# Altium project BCM_ECU.PrjPcb (part 3 of 3)

## Sheet MCP23017_PINOUT.SchDoc
size B; SheetNumber: 11; SheetTotal: 15
Used 2 times, as channels IO_CHECKER_0, IO_CHECKER_1. Parts and nets are listed once, with the designators drawn on the sheet.
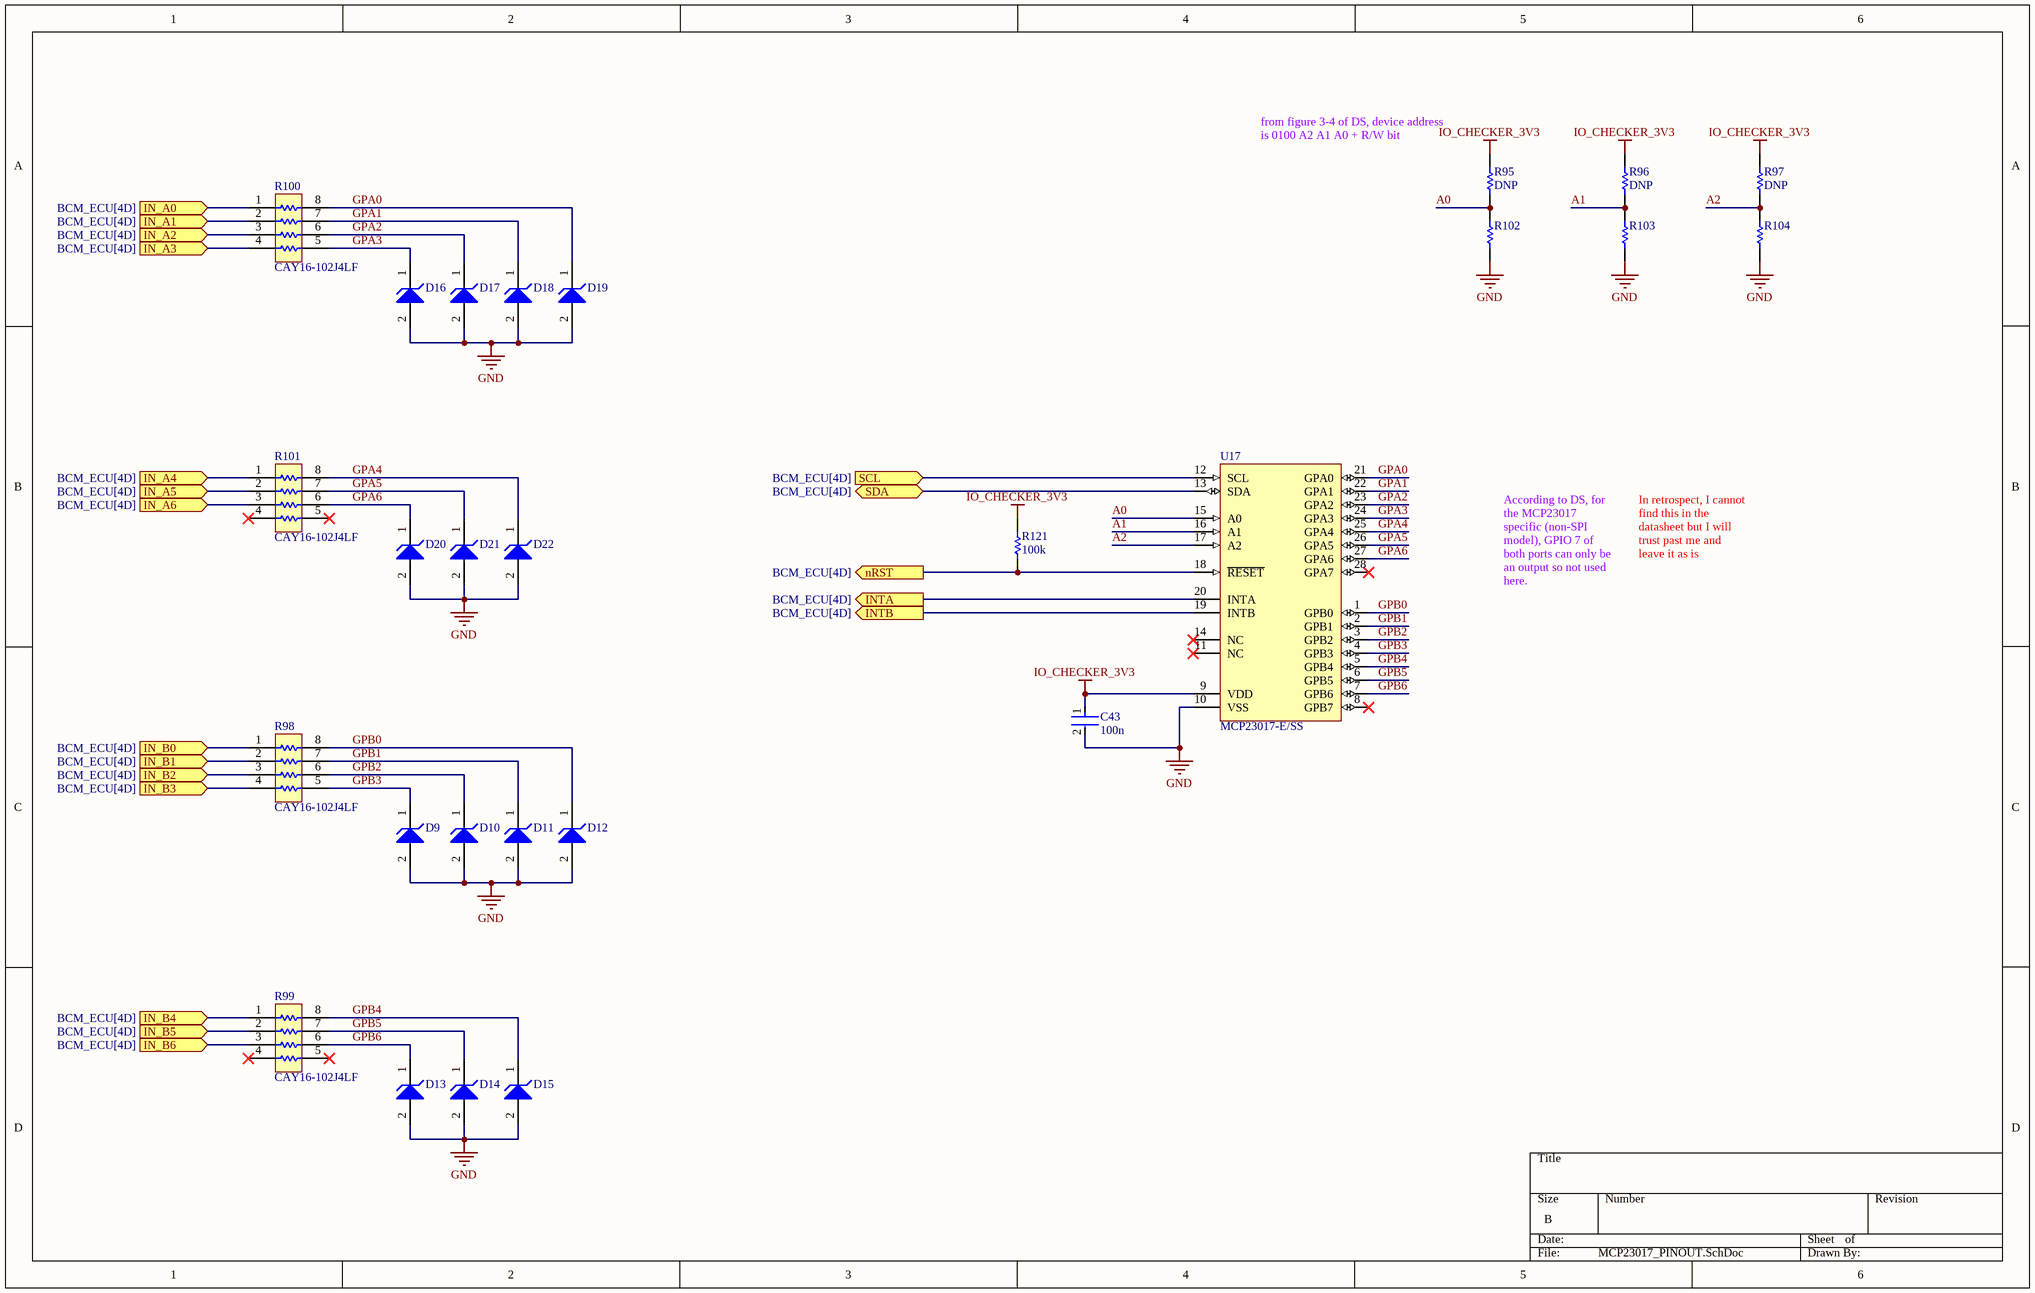
[diagram p16: MCP23017_PINOUT.SchDoc]

### Parts
C43  100n  [FP-0402-L_1_0_0_05-W_0_5-IPC_A]
D9  MM5Z3V3T1G  [ONSC-SOD-523-2-502-01_V]  (value not drawn)
D10  MM5Z3V3T1G  [ONSC-SOD-523-2-502-01_V]  (value not drawn)
D11  MM5Z3V3T1G  [ONSC-SOD-523-2-502-01_V]  (value not drawn)
D12  MM5Z3V3T1G  [ONSC-SOD-523-2-502-01_V]  (value not drawn)
D13  MM5Z3V3T1G  [ONSC-SOD-523-2-502-01_V]  (value not drawn)
D14  MM5Z3V3T1G  [ONSC-SOD-523-2-502-01_V]  (value not drawn)
D15  MM5Z3V3T1G  [ONSC-SOD-523-2-502-01_V]  (value not drawn)
D16  MM5Z3V3T1G  [ONSC-SOD-523-2-502-01_V]  (value not drawn)
D17  MM5Z3V3T1G  [ONSC-SOD-523-2-502-01_V]  (value not drawn)
D18  MM5Z3V3T1G  [ONSC-SOD-523-2-502-01_V]  (value not drawn)
D19  MM5Z3V3T1G  [ONSC-SOD-523-2-502-01_V]  (value not drawn)
D20  MM5Z3V3T1G  [ONSC-SOD-523-2-502-01_V]  (value not drawn)
D21  MM5Z3V3T1G  [ONSC-SOD-523-2-502-01_V]  (value not drawn)
D22  MM5Z3V3T1G  [ONSC-SOD-523-2-502-01_V]  (value not drawn)
R95  DNP  [R0603B]
R96  DNP  [R0603B]
R97  DNP  [R0603B]
R98  CAY16-102J4LF  [BOUR-CAY16-J4_V]
R99  CAY16-102J4LF  [BOUR-CAY16-J4_V]
R100  CAY16-102J4LF  [BOUR-CAY16-J4_V]
R101  CAY16-102J4LF  [BOUR-CAY16-J4_V]
R102  DNP  [RESC1005X40X25ML05T05]  (value not drawn)
R103  DNP  [RESC1005X40X25ML05T05]  (value not drawn)
R104  DNP  [RESC1005X40X25ML05T05]  (value not drawn)
R121  100k  [R0603B]
U17  MCP23017-E/SS  [SSOP-SS28_N]

### Ports
IN_A0 (in, see BCM_ECU[4D]), IN_A1 (in, see BCM_ECU[4D]), IN_A2 (in, see BCM_ECU[4D]), IN_A3 (in, see BCM_ECU[4D]), IN_A4 (in, see BCM_ECU[4D]), IN_A5 (in, see BCM_ECU[4D]), IN_A6 (in, see BCM_ECU[4D]), IN_B0 (in, see BCM_ECU[4D]), IN_B1 (in, see BCM_ECU[4D]), IN_B2 (in, see BCM_ECU[4D]), IN_B3 (in, see BCM_ECU[4D]), IN_B4 (in, see BCM_ECU[4D]), IN_B5 (in, see BCM_ECU[4D]), IN_B6 (in, see BCM_ECU[4D]), INTA (out, see BCM_ECU[4D]), INTB (out, see BCM_ECU[4D]), nRST (out, see BCM_ECU[4D]), SCL (in, see BCM_ECU[4D]), SDA (bidir, see BCM_ECU[4D])

### Nets
GND: C43.2 D9.2(A) D10.2(A) D11.2(A) D12.2(A) D13.2(A) D14.2(A) D15.2(A) D16.2(A) D17.2(A) D18.2(A) D19.2(A) D20.2(A) D21.2(A) D22.2(A) R102.1 R103.1 R104.1 U17.10(VSS)
IO_CHECKER_3V3: C43.1 R95.2 R96.2 R97.2 R121.2 U17.9(VDD)
A0: R95.1 R102.2 U17.15(A0)
A1: R96.1 R103.2 U17.16(A1)
A2: R97.1 R104.2 U17.17(A2)
GPA0: D19.1(K) R100.8 U17.21(GPA0)
GPA1: D18.1(K) R100.7 U17.22(GPA1)
GPA2: D17.1(K) R100.6 U17.23(GPA2)
GPA3: D16.1(K) R100.5 U17.24(GPA3)
GPA4: D22.1(K) R101.8 U17.25(GPA4)
GPA5: D21.1(K) R101.7 U17.26(GPA5)
GPA6: D20.1(K) R101.6 U17.27(GPA6)
GPB0: D12.1(K) R98.8 U17.1(GPB0)
GPB1: D11.1(K) R98.7 U17.2(GPB1)
GPB2: D10.1(K) R98.6 U17.3(GPB2)
GPB3: D9.1(K) R98.5 U17.4(GPB3)
GPB4: D15.1(K) R99.8 U17.5(GPB4)
GPB5: D14.1(K) R99.7 U17.6(GPB5)
GPB6: D13.1(K) R99.6 U17.7(GPB6)
IN_A0: R100.1 ; port IN_A0
IN_A1: R100.2 ; port IN_A1
IN_A2: R100.3 ; port IN_A2
IN_A3: R100.4 ; port IN_A3
IN_A4: R101.1 ; port IN_A4
IN_A5: R101.2 ; port IN_A5
IN_A6: R101.3 ; port IN_A6
IN_B0: R98.1 ; port IN_B0
IN_B1: R98.2 ; port IN_B1
IN_B2: R98.3 ; port IN_B2
IN_B3: R98.4 ; port IN_B3
IN_B4: R99.1 ; port IN_B4
IN_B5: R99.2 ; port IN_B5
IN_B6: R99.3 ; port IN_B6
INTA: U17.20(INTA) ; port INTA
INTB: U17.19(INTB) ; port INTB
nRST: R121.1 U17.18(~{RESET}) ; port nRST
SCL: U17.12(SCL) ; port SCL
SDA: U17.13(SDA) ; port SDA

Not connected (* = marked no-connect by the designer): R99 4* 5*; R101 4* 5*; U17 8(GPB7)* 11(NC)* 14(NC)* 28(GPA7)*

### Channels
IO_CHECKER_0: designators end in _IO_CHECKER_0; ports IN_A0=EXT_IN_1 IN_A1=EXT_IN_2 IN_A2=OUT_1 IN_A3=EXT_IN_0 IN_A4=EXT_IN_3 IN_A5=OUT_0 IN_A6=NetR101_IO_CHECKER_0_3 IN_B0=EXT_INT_6 IN_B1=EXT_INT_2 IN_B2=EXT_INT_5 IN_B3=EXT_INT_1 IN_B4=EXT_INT_4 IN_B5=EXT_INT_0 IN_B6=EXT_INT_3 INTA=NetU10_61 INTB=NetU10_60 nRST=NetR121_IO_CHECKER_0_1 SCL=IO_CHKR_SCL SDA=IO_CHKR_SDA
IO_CHECKER_1: designators end in _IO_CHECKER_1; ports IN_A0=OUT_13 IN_A1=OUT_12 IN_A2=OUT_10 IN_A3=OUT_15 IN_A4=OUT_11 IN_A5=OUT_14 IN_A6=OUT_8 IN_B0=OUT_9 IN_B1=OUT_6 IN_B2=OUT_7 IN_B3=OUT_4 IN_B4=OUT_5 IN_B5=OUT_2 IN_B6=OUT_3 INTA=NetU10_91 INTB=NetU10_90 nRST=NetR121_IO_CHECKER_1_1 SCL=IO_CHKR_SCL SDA=IO_CHKR_SDA

### Notes on the sheet
- (near R95) from figure 3-4 of DS, device address is 0100 A2 A1 A0 + R/W bit
- According to DS, for the MCP23017 specific (non-SPI model), GPIO 7 of both ports can only be an output so not used here.
- In retrospect, I cannot find this in the datasheet but I will trust past me and leave it as is

### Library data of the parts
C43 = CMP-001-00058-1: LARGE PADS, 0402 CAP, CHANGE COMMENT TO MATCH REAL P/N; Capacitor Type: Ceramic; Min Operating Temperature: -55°C; Mounting Technology: Surface Mount; Pins: 2; Case/Package: 0402; RoHS Compliant: Yes; Max Operating Temperature: 85°C
D9-D22 = CMP-1060-00750-1: Zener Voltage Regulator, 500 mW, 2-Pin SOD-523, Pb-Free, Tape and Reel; Manufacturer: On Semiconductor; P Max (W): 0.5; VZ Typ (V): 3.3; RoHS: Pb-Free; ComponentLink2Description: Datasheet; PackageReference: SOD-523-2-502-01; DatasheetVersion: Rev. 10; ComponentLink1Description: Manufacturer URL; PackageVersion: Rev. E, 09/2010; ComponentLink3URL: http://www.onsemi.com/pub_link/Collateral/502-01.PDF; ComponentLink2URL: http://www.onsemi.cn/pub_link/Collateral/MM5Z2V4T1-D.PDF; Mounting Technology: Surface Mount; PartNumber: MM5Z3V3T1G; Packing: Tape and Reel; PackageDescription: 2-Pin SOD, Body 1.2 x 0.8 mm; ComponentLink1URL: http://www.onsemi.com/; ComponentLink3Description: Package Specification
R95-R97 = CMP-009-00002-14: Resistor; Value: 100k
R98-R101 = CMP-1747-00007-1: Chip Resistor Array, 1 KOhm, +/- 5%, 62.5 mW, -55 to 125 degC, 8-Pin SMD, RoHS, Tape and Reel; Power Rating: 100 mW; Tolerance: 1%; Voltage Rating (DC): 50 V; Resistance: 330 Ohm; Case\Package: 0603; RoHSCompliant: true; Case Code (Metric): 1608; Pins: 2; PackageDescription: 8-Pin Surface Mount Device, Body 1.6 x 3.2 mm, Pitch 0.8 mm; Height: 0.45 mm; Min Operating Temperature: -55 degC; ComponentLink1URL: http://www.bourns.com/; Case Code (Imperial): 0603; Packaging: Tape and Reel; PackageReference: CAY16-J4; ComponentLink1Description: Manufacturer URL; ComponentLink2Description: Datasheet; Length: 1.6 mm; Width: 0.8 mm; Max Operating Temperature: 155 degC; Mount: Surface Mount; DatasheetVersion: Sep-14; Voltage Rating: 50 V; REACH SVHC: No SVHC; ComponentLink2URL: http://www.bourns.com/pdfs/CATCAY.pdf; Package Quantity: 5000
R102-R104 = CMP-009-00118-2: READ THE NAME; Pins: 2; Component Type: Standard; Design Item ID: CMP-009-00206-2; Source: 0402jump.SchLib
R121 = CMP-009-00002-14: Resistor; Value: 100k
U17 = CMP-0186-00176-2: 16-Bit I/O Expander with Serial Interface, 28-Pin SSOP, Extended Temperature; PackageVersion: revBB, Aug-2009; ComponentLink1Description: Manufacturer URL; ComponentLink3Description: Package Specification; PackageDescription: 28-Lead Plastic Shrink Small Outline (SS) - 5.3mm Body [SSOP]; ComponentLink1URL: http://www.microchip.com/; Code_JEDEC: MS-150; RevisionNote: URLs added.; ComponentLink3URL: http://www.microchip.com/stellent/groups/techpub_sg/documents/packagingspec/en012702.pdf; ComponentLink2URL: http://ww1.microchip.com/downloads/en/DeviceDoc/21952b.pdf; ComponentLink2Description: Datasheet; PackageReference: SSOP-SS28; DatasheetVersion: revB, Feb-2007

## Sheet TPA3255_PINOUT.SchDoc
size B; SheetNumber: 12; SheetTotal: 15
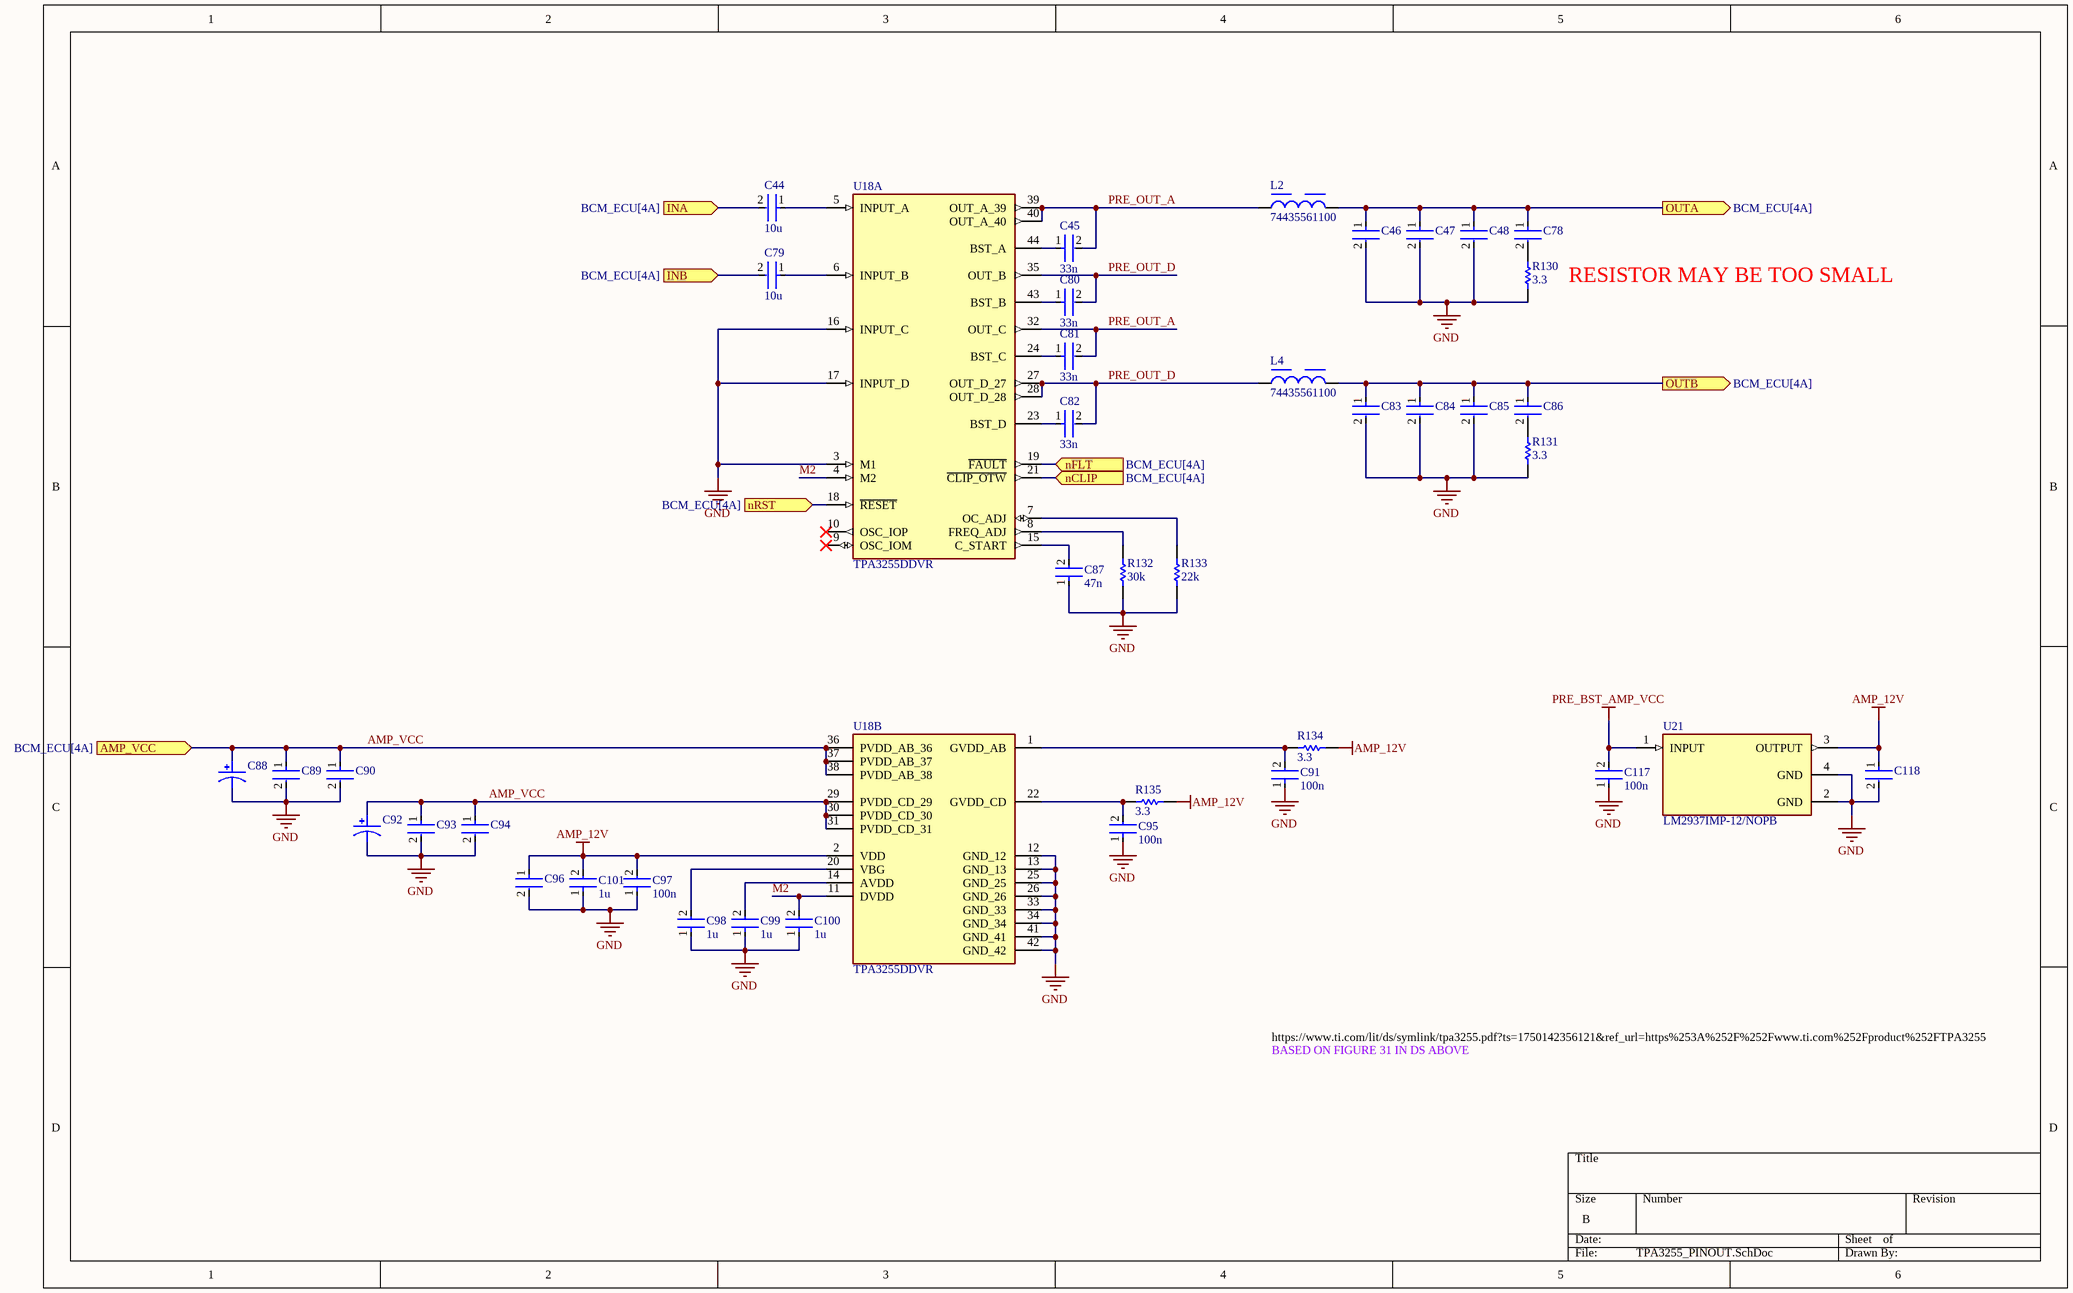
[diagram p17: TPA3255_PINOUT.SchDoc]

### Parts
C44  10u  [FP-0402-L_1_0_0_05-W_0_5-IPC_A]
C45  33n  [FP-0402-L_1_0_0_05-W_0_5-IPC_A]
C46  22201C474KAT2A  [FP-2220-L_5_7_0_5-W_5_0_4-IPC_A]  (value not drawn)
C47  22201C474KAT2A  [FP-2220-L_5_7_0_5-W_5_0_4-IPC_A]  (value not drawn)
C48  12061C102KAT2A  [FP-1206-L_3_2_0_2-W_1_6_0-MFG]  (value not drawn)
C78  C0805C103K2RACTU  [FP-C0805C-DN-MFG]  (value not drawn)
C79  10u  [FP-0402-L_1_0_0_05-W_0_5-IPC_A]
C80  33n  [FP-0402-L_1_0_0_05-W_0_5-IPC_A]
C81  33n  [FP-0402-L_1_0_0_05-W_0_5-IPC_A]
C82  33n  [FP-0402-L_1_0_0_05-W_0_5-IPC_A]
C83  22201C474KAT2A  [FP-2220-L_5_7_0_5-W_5_0_4-IPC_A]  (value not drawn)
C84  22201C474KAT2A  [FP-2220-L_5_7_0_5-W_5_0_4-IPC_A]  (value not drawn)
C85  12061C102KAT2A  [FP-1206-L_3_2_0_2-W_1_6_0-MFG]  (value not drawn)
C86  C0805C103K2RACTU  [FP-C0805C-DN-MFG]  (value not drawn)
C87  47n  [FP-0402-L_1_0_0_05-W_0_5-IPC_A]
C88  MAL215099913E3  [MAL215099913E3-Footprint-1]  (value not drawn)
C89  HMK325B7105KN-T  [FP-1210-L_3_2_0_3-W_2_5_0-IPC_B]  (value not drawn)
C90  HMK325B7105KN-T  [FP-1210-L_3_2_0_3-W_2_5_0-IPC_B]  (value not drawn)
C91  100n  [FP-0402-L_1_0_0_05-W_0_5-IPC_A]
C92  MAL215099913E3  [MAL215099913E3-Footprint-1]  (value not drawn)
C93  HMK325B7105KN-T  [FP-1210-L_3_2_0_3-W_2_5_0-IPC_B]  (value not drawn)
C94  HMK325B7105KN-T  [FP-1210-L_3_2_0_3-W_2_5_0-IPC_B]  (value not drawn)
C95  100n  [FP-0402-L_1_0_0_05-W_0_5-IPC_A]
C96  12103D106KAT2A  [FP-1210-L_3_3_0_4-W_2_5_0-MFG]  (value not drawn)
C97  100n  [FP-0402-L_1_0_0_05-W_0_5-IPC_A]
C98  1u  [FP-0402-L_1_0_0_05-W_0_5-IPC_A]
C99  1u  [FP-0402-L_1_0_0_05-W_0_5-IPC_A]
C100  1u  [FP-0402-L_1_0_0_05-W_0_5-IPC_A]
C101  1u  [FP-0402-L_1_0_0_05-W_0_5-IPC_A]
C117  100n  [FP-0402-L_1_0_0_05-W_0_5-IPC_A]
C118  12103D106KAT2A  [FP-1210-L_3_3_0_4-W_2_5_0-MFG]  (value not drawn)
L2  74435561100  [WE-HCI_1890]
L4  74435561100  [WE-HCI_1890]
R130  3.3  [R0603B]
R131  3.3  [R0603B]
R132  30k  [R0603B]
R133  22k  [R0603B]
R134  3.3  [R0603B]
R135  3.3  [R0603B]
U18  TPA3255DDVR  [TPA3255DDVR-Footprint-1]  (parts A,B of 2)
U21  LM2937IMP-12/NOPB  [FP-DCY0004A-MFG]

### Ports
AMP_VCC (in, see BCM_ECU[4A]), INA (in, see BCM_ECU[4A]), INB (in, see BCM_ECU[4A]), nCLIP (in, see BCM_ECU[4A]), nFLT (in, see BCM_ECU[4A]), nRST (in, see BCM_ECU[4A]), OUTA (out, see BCM_ECU[4A]), OUTB (out, see BCM_ECU[4A])

### Nets
AMP_12V: C96.1 C97.2 C101.2 C118.1 R134.1 R135.1 U18.2(VDD) U21.3(OUTPUT)
GND: C46.2 C47.2 C48.2 C79.2 C83.2 C84.2 C85.2 C87.1 C88.2 C89.2 C90.2 C91.1 C92.2 C93.2 C94.2 C95.1 C96.2 C97.1 C98.1 C99.1 C100.1 C101.1 C117.1 C118.2 R130.1 R131.1 R132.2 R133.2 U18.3(M1) U18.12(GND_12) U18.13(GND_13) U18.16(INPUT_C) U18.17(INPUT_D) U18.25(GND_25) U18.26(GND_26) U18.33(GND_33) U18.34(GND_34) U18.41(GND_41) U18.42(GND_42) U21.2(GND) U21.4(GND) ; port INB
PRE_BST_AMP_VCC: C117.2 U21.1(INPUT)
AMP_VCC: C88.1 C89.1 C90.1 C92.1 C93.1 C94.1 U18.29(PVDD_CD_29) U18.30(PVDD_CD_30) U18.31(PVDD_CD_31) U18.36(PVDD_AB_36) U18.37(PVDD_AB_37) U18.38(PVDD_AB_38) ; port AMP_VCC
M2: C100.2 U18.4(M2) U18.11(DVDD)
PRE_OUT_A: C45.2 C81.2 L2.1 U18.32(OUT_C) U18.39(OUT_A_39) U18.40(OUT_A_40)
PRE_OUT_D: C80.2 C82.2 L4.1 U18.27(OUT_D_27) U18.28(OUT_D_28) U18.35(OUT_B)
SPKR_A: C46.1 C47.1 C48.1 C78.1 L2.2 ; port OUTA
SPKR_B: C83.1 C84.1 C85.1 C86.1 L4.2 ; port OUTB
NetC44_1: C44.1 U18.5(INPUT_A)
NetC44_2: C44.2 ; port INA
NetC45_1: C45.1 U18.44(BST_A)
NetC78_2: C78.2 R130.2
NetC79_1: C79.1 U18.6(INPUT_B)
NetC80_1: C80.1 U18.43(BST_B)
NetC81_1: C81.1 U18.24(BST_C)
NetC82_1: C82.1 U18.23(BST_D)
NetC86_2: C86.2 R131.2
NetC87_2: C87.2 U18.15(C_START)
NetC91_2: C91.2 R134.2 U18.1(GVDD_AB)
NetC95_2: C95.2 R135.2 U18.22(GVDD_CD)
NetC98_2: C98.2 U18.20(VBG)
NetC99_2: C99.2 U18.14(AVDD)
NetR132_1: R132.1 U18.8(FREQ_ADJ)
NetR133_1: R133.1 U18.7(OC_ADJ)
NetU10_17: U18.21(~{CLIP_OTW}) ; port nCLIP
NetU10_18: U18.18(~{RESET}) ; port nRST
NetU10_54: U18.19(~{FAULT}) ; port nFLT

Not connected (* = marked no-connect by the designer): U18 9(OSC_IOM)* 10(OSC_IOP)*

### Notes on the sheet
- RESISTOR MAY BE TOO SMALL
- https://www.ti.com/lit/ds/symlink/tpa3255.pdf?ts=1750142356121&ref_url=https%253A%252F%252Fwww.ti.com%252Fproduct%252FTPA3255
- BASED ON FIGURE 31 IN DS ABOVE

### Library data of the parts
C44 C45 C79-C82 C87 C91 C95 C97-C101 C117 = CMP-001-00058-1: as C43 on sheet MCP23017_PINOUT; Min Operating Temperature: -55°C; Mounting Technology: Surface Mount; Pins: 2; Case/Package: 0402; RoHS Compliant: Yes; Max Operating Temperature: 85°C
C46 C47 C83 C84 = CMP-04427-001121-1: General Purpose Ceramic Capacitor, 2220, 470nF, 10%, X7R, 15%, 100V; Length: 5.7mm; RoHS Compliant: Yes; Lead Free: Lead Free; Width: 5mm; Dielectric: X7R; Max Operating Temperature: 125°C; Case Code (Imperial): 2220; Capacitance: 470nF; Packaging: Tape and Reel; Termination: SMD/SMT; Mount: Surface Mount; Case/Package: 2220; Height: 1.52mm; Number of Pins: 2; Tolerance: 10%; Case Code (Metric): 5750; Construction: Flat; Min Operating Temperature: -55°C; Radiation Hardening: No; Depth: 5mm; Weight: 0.016932oz; REACH SVHC: No SVHC; Voltage Rating: 100V; Voltage Rating (DC): 100V
C48 C85 = CMP-2000-05860-2: General Purpose Ceramic Capacitor, 1206, 1nF, 10%, X7R, 15%, 100V; Voltage: 63V; Dissipation Factor: 2.5%; Insulation Resistance: 100GR; Lead Free: Lead Free; Contact Plating: Tin; Case/Package: 1206; Dielectric Material: Ceramic; Thickness: 0.037inch; Construction: Flat; Series: -; Max Operating Temperature: 125°C; RoHS Compliant: Yes; Min Operating Temperature: -55°C; Tolerance: 10%; Size: 0.94mm; Width: 0.063inch; Case Code (Metric): 3216; Package Quantity: 1; Height: 0.94mm; Capacitance: 1nF; Voltage Rating (DC): 100V; Dielectric: X7R; Depth: 1.6mm; Number of Pins: 2; REACH SVHC: No SVHC; Radiation Hardening: No; Packaging: Tape and Reel; Termination: SMD/SMT; Voltage Rating: 100V; Case Code (Imperial): 1206; Length: 3.2mm; Mount: Surface Mount
C78 C86 = CMP-2007-00259-2: CAP CER 10000PF 200V X7R 0805; Manufacturer: KEMET; Material: Ceramic; Temperature Coefficient: 30ppm/°C; Capacitance: 10,000 pF; Tolerance: 0.1; Value: 10,000 pF; Device Class L2: Capacitors; Voltage Rating: 200 V; Temperature Range High: +125°C; ComponentLink2Description: Datasheet; Height: 0.88mm; Octopart: https://octopart.com/c0805c103k2ractu-kemet-9138347; ComponentLink2URL: https://content.kemet.com/datasheets/KEM_C1003_C0G_SMD.pdf; Category: Cap; Temperature: -55°C to +125°C; Temperature Range Low: -55°C; Digikey Description: CAP CER 10000PF 200V X7R 0805; Manufacturer Part Number: C0805C103K2RACTU; Temperature Characteristic: X7R; Automotive: No; Device Class L3: Ceramic Capacitors; Mouser Description: KEMET - C0805C103K2RACTU - CAP, MLCC, X7R, 10NF, 200V, 0805; RoHS: TRUE; Device Class L1: Passive Components; Lead Free: Yes; Package: C0805C-DN; Ipc Land Pattern Name: CAPC200125X78
C88 C92 = CMP-001-00064-1: Aluminum Electrolytic Capacitor, Polarized, Aluminum (wet), 100V, 20% +Tol, 20% -Tol, 470uF, Surface Mount, 7171; Value: 470µF; Capacitor Type: Aluminium; RoHS Compliant: Yes; Case/Package: 7171; Pins: 2; Max Operating Temperature: 105°C; Min Operating Temperature: -40°C
C89 C90 C93 C94 = CMP-14477-002774-2: None; Dielectric: X5R; Capacitance: 1uF; Voltage Rating (DC): 100V; Tolerance: 10%; Length: 3.2mm; Thickness: 0.083inch; Construction: Flat; Width: 2.5mm; Number of Pins: 2; Height: 1.9mm; REACH SVHC: No SVHC; Case Code (Metric): 3225; Termination: SMD/SMT; Packaging: Tape and Reel; Resistor Type: Ceramic; Mount: Surface Mount; Radiation Hardening: No; Case/Package: 1210; Case Code (Imperial): 1210; Min Operating Temperature: -55°C; Max Operating Temperature: 125°C; Halogen Free: Halogen Free; Voltage Rating: 100V; Depth: 2.5mm; Package Quantity: 1; RoHS Compliant: Yes; Voltage: 100V; Series: M
C96 C118 = CMP-2000-05477-2: General Purpose Ceramic Capacitor, 1210, 10uF, 10%, X5R, 15%, 25V; Lead Free: Lead Free; Max Operating Temperature: 85°C; REACH SVHC: No SVHC; Depth: 2.5mm; Packaging: Tape and Reel; Min Operating Temperature: -55°C; Height: 2.29mm; Construction: Flat; Case Code (Imperial): 1210; Radiation Hardening: No; Voltage: 25V; Case/Package: 1210; Series: -; Dielectric: X5R; Length: 3.2mm; Thickness: 0.11inch; Package Quantity: 1; Termination: SMD/SMT; Case Code (Metric): 3225; Voltage Rating (DC): 25V; Voltage Rating: 25V; Contact Plating: Tin; RoHS Compliant: Yes; Mount: Surface Mount; Width: 0.098inch; Capacitance: 10uF; Tolerance: 10%
L2 L4 = CMP-0226-00001-2: NexarPartId: 22803350; Inductance Tolerance: 20%; DC Resistance (DCR): 6.9mΩ; Inductance: 10µH; Saturation Current: 10A; Self Resonant Frequency: 14MHz; Width: 18.2mm; Packaging: Cut Tape (CT); Max Operating Temperature: 150°C; Number of Pins: 2; Length: 18.3mm; Min Operating Temperature: -40°C; RoHS: Compliant; Ambient Temperature Range Low: -40°C; Ambient Temperature Range High: 100°C; Height: 8.9mm
R130-R135 = CMP-009-00002-14: Resistor; Value: 100k
U18 = CMP-014-00024-1: Audio Amplifier, 315W, 4 Channel(s), 1 Func, PDSO44; RoHS Compliant: Yes
U21 = CMP-0062-01737-4: IC REG LINEAR 12V 400MA SOT223-4; Number of Outputs: 1; Quiescent Current: 10mA; Dropout Voltage: 500mV; Polarity: Positive; Min Input Voltage: 0uV; Output Voltage Accuracy: 5%; Max Input Voltage: 26V; Current Rating: 500A; Output Current: 500mA; Output Type: Fixed; REACH SVHC: No SVHC; Termination: SMD/SMT; Min Operating Temperature: -40°C; Output Voltage: 12V; Height: 1.6mm; Radiation Hardening: No; Contact Plating: Tin; Mount: Surface Mount; Max Operating Temperature: 125°C; Packaging: Tape and Reel; Package Quantity: 1000; RoHS Compliant: Yes; Nominal Output Voltage: 12V; Accuracy: 5%; Max Output Current: 500mA; Width: 3.56mm; Length: 6.5mm; Lead Free: Lead Free; Case/Package: SOT-223; Number of Pins: 4

## Sheet SD_CARD.SchDoc
size A4; SheetNumber: 14; SheetTotal: 15
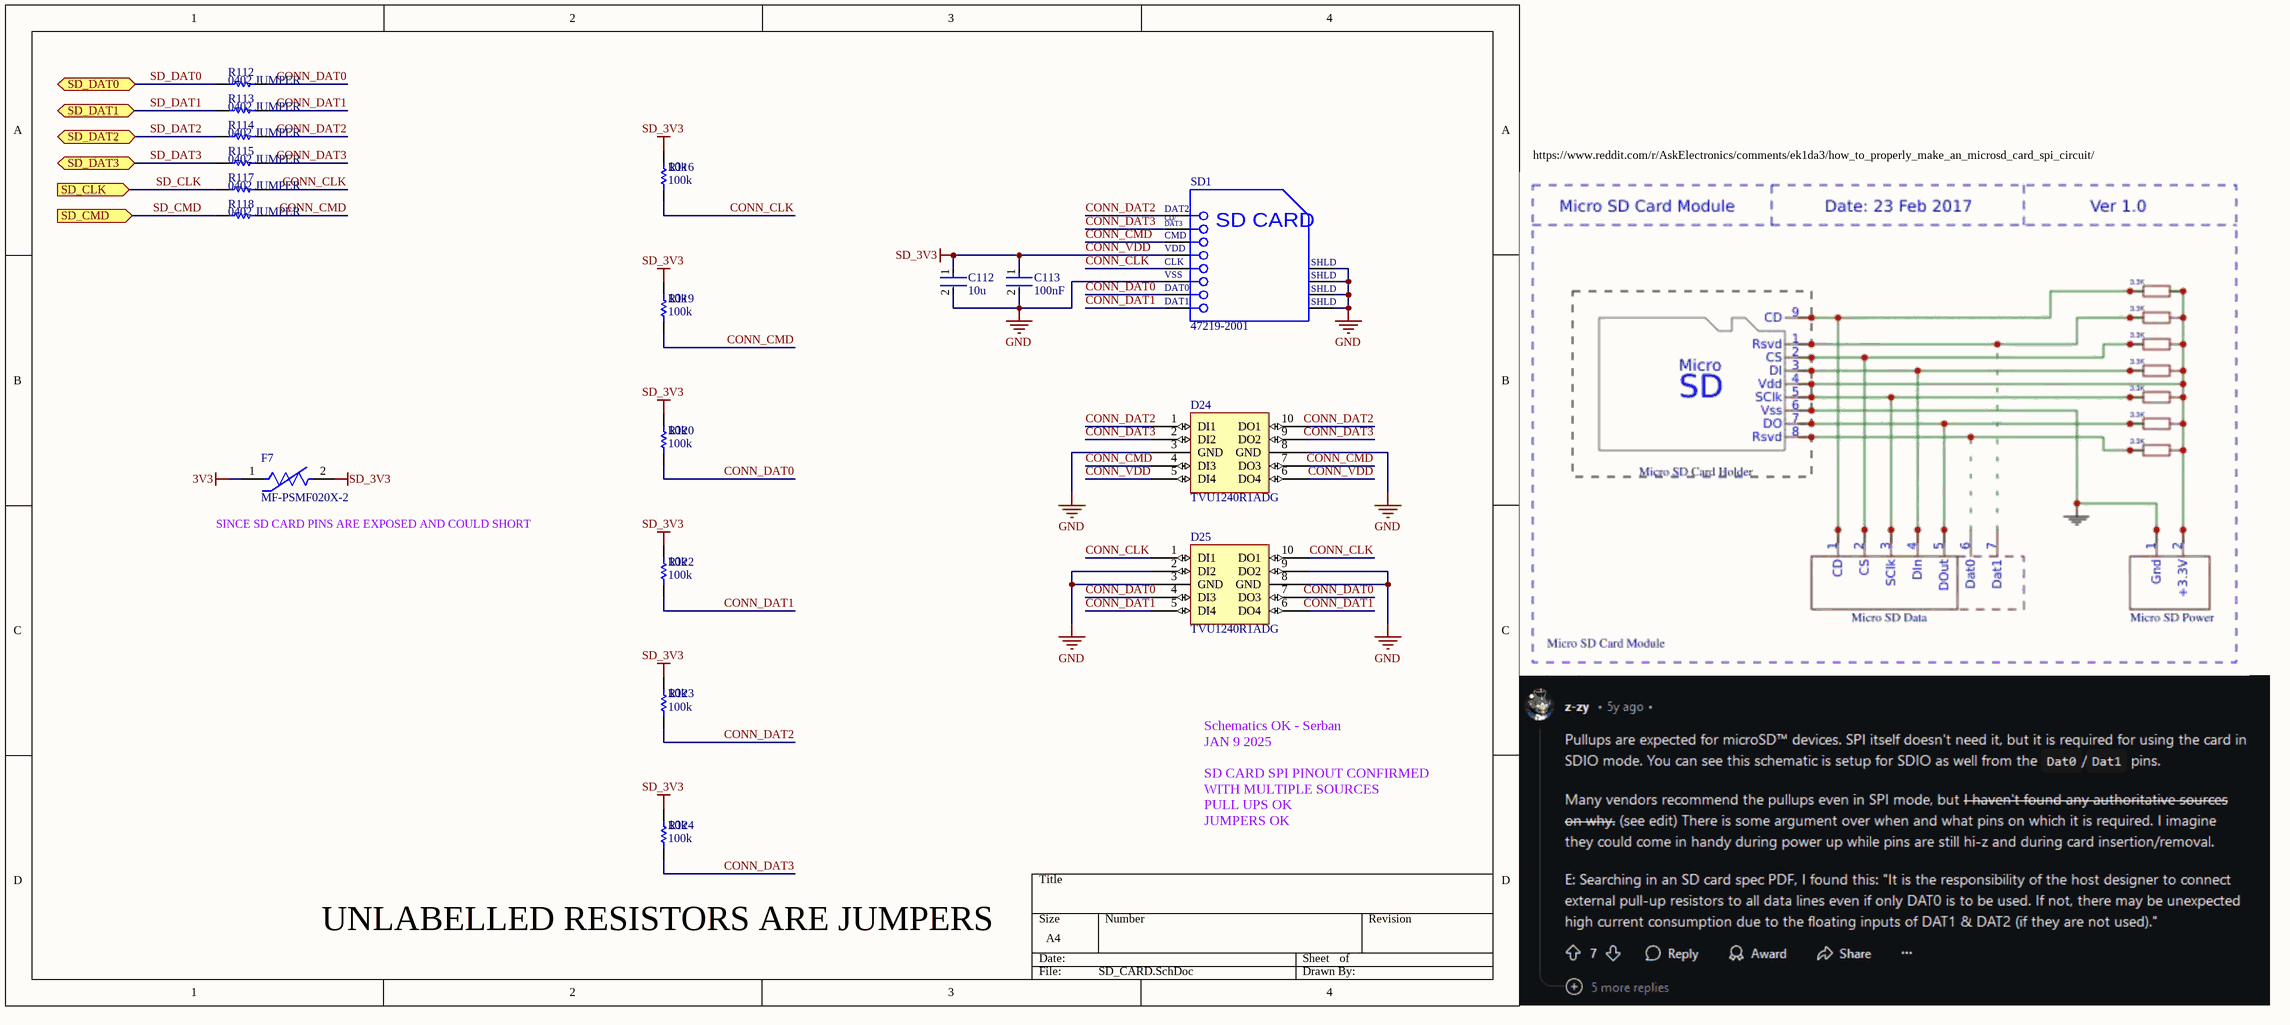
[diagram p18: SD_CARD.SchDoc]

### Parts
C112  10u  [FP-0402-L_1_0_0_05-W_0_5-IPC_A]
C113  100nF  [FP-0402-L_1_0_0_05-W_0_5-IPC_A]
D24  TVU1240R1ADG  [CAF-50P250X100-10N]
D25  TVU1240R1ADG  [CAF-50P250X100-10N]
F7  MF-PSMF020X-2  [FP-MF-PSMF-MFG]
R112  0402 JUMPER  [RESC1005X40X25ML05T05]
R113  0402 JUMPER  [RESC1005X40X25ML05T05]
R114  0402 JUMPER  [RESC1005X40X25ML05T05]
R115  0402 JUMPER  [RESC1005X40X25ML05T05]
R116  100k  value 10k  [R0603B]
R117  0402 JUMPER  [RESC1005X40X25ML05T05]
R118  0402 JUMPER  [RESC1005X40X25ML05T05]
R119  100k  value 10k  [R0603B]
R120  100k  value 10k  [R0603B]
R122  100k  value 10k  [R0603B]
R123  100k  value 10k  [R0603B]
R124  100k  value 10k  [R0603B]
SD1  47219-2001  [MOLX-47219-2001-8_V]

### Ports
SD_CLK (in, see BCM_ECU[5C]), SD_CMD (in, see BCM_ECU[5C]), SD_DAT0 (bidir, see BCM_ECU[5C]), SD_DAT1 (bidir, see BCM_ECU[5C]), SD_DAT2 (bidir, see BCM_ECU[5C]), SD_DAT3 (bidir, see BCM_ECU[5C])

### Nets
3V3: F7.1
CONN_VDD: C112.1 C113.1 D24.5(DI4) D24.6(DO4) F7.2 R116.2 R119.2 R120.2 R122.2 R123.2 R124.2 SD1.4(VDD)  [also labelled SD_3V3]
GND: C112.2 C113.2 D24.3(GND) D24.8(GND) D25.2(DI2) D25.3(GND) D25.8(GND) D25.9(DO2) SD1.6(VSS) SD1.9(SHLD) SD1.10(SHLD) SD1.11(SHLD) SD1.12(SHLD)
CONN_CLK: D25.1(DI1) D25.10(DO1) R116.1 R117.2 SD1.5(CLK)
CONN_CMD: D24.4(DI3) D24.7(DO3) R118.2 R119.1 SD1.3(CMD)
CONN_DAT0: D25.4(DI3) D25.7(DO3) R112.2 R120.1 SD1.7(DAT0)
CONN_DAT1: D25.5(DI4) D25.6(DO4) R113.2 R122.1 SD1.8(DAT1)
CONN_DAT2: D24.1(DI1) D24.10(DO1) R114.2 R123.1 SD1.1(DAT2)
CONN_DAT3: D24.2(DI2) D24.9(DO2) R115.2 R124.1 SD1.2(CD/DAT3)
SD_CLK: R117.1 ; port SD_CLK
SD_CMD: R118.1 ; port SD_CMD
SD_DAT0: R112.1 ; port SD_DAT0
SD_DAT1: R113.1 ; port SD_DAT1
SD_DAT2: R114.1 ; port SD_DAT2
SD_DAT3: R115.1 ; port SD_DAT3

### Notes on the sheet
- https://www.reddit.com/r/AskElectronics/comments/ek1da3/how_to_properly_make_an_microsd_card_spi_circuit/
- (near F7) SINCE SD CARD PINS ARE EXPOSED AND COULD SHORT
- Schematics OK - Serban
  JAN 9 2025
  SD CARD SPI PINOUT CONFIRMED WITH MULTIPLE SOURCES
  PULL UPS OK
  JUMPERS OK
- UNLABELLED RESISTORS ARE JUMPERS
- (in symbol CMP-2000-05245-1) CD/; DAT3; SD CARD

### Library data of the parts
C112 C113 = CMP-001-00058-1: as C43 on sheet MCP23017_PINOUT; Min Operating Temperature: -55°C; Mounting Technology: Surface Mount; Pins: 2; Case/Package: 0402; RoHS Compliant: Yes; Max Operating Temperature: 85°C
D24 D25 = CMP-004-00060-2
F7 = CMP-07400-000005-1: PTC RESET FUSE 9V 200MA 0805; Manufacturer: Bourns; Description: Polymeric PTC Resettable Fuse 9V 200mA Ih Surface Mount 0805 (2012 Metric), Concave; Trip Current: 0.5A; Resistance: 0.65-3.5Ω; Current Rating: 40A; Value: 0.65-3.5Ω; Trip Time: 0.02s; Hold Current: 0.2A; ComponentLink2Description: Datasheet; Manufacturer Part Number: MF-PSMF020X-2; Height: 0.85mm; Ambient Temperature Range High: +85°C; Category: Fuse; Temperature Range Low: -40°C; ComponentLink2URL: https://www.bourns.com/docs/Product-Datasheets/mfpsmf.pdf; Temperature Range High: +85°C; RoHS: TRUE; Device Class L1: Circuit Protection; Device Class L3: unset; Package: MF-PSMF; Digikey Description: PTC RESET FUSE 9V 200MA 0805; Mouser Description: PTC Resettable Fuse 0.2A(hold) 0.5A(trip) 9V 40A 0.5W 0.02s 0.65Ohm SMD Solder Pad 0805 T/R; Voltage Rating: 9V; Automotive: No; Device Class L2: PTC Resettable Fuses; Temperature: -40°C to +85°C; Lead Free: Yes; Octopart: https://octopart.com/mf-psmf020x-2-bourns-7483437; Ambient Temperature Range Low: -40°C
R112-R115 R117 R118 = CMP-009-00118-2: READ THE NAME; Pins: 2; Component Type: Standard; Design Item ID: CMP-009-00206-2; Source: 0402jump.SchLib; Value: 0402 JUMPER
R116 R119 R120 R122-R124 = CMP-009-00002-14: Resistor
SD1 = CMP-2000-05245-1: MicroSD Card Connector, Hinge Type, -40 to 85 degC, 8-Pin SMD, RoHS, Tape and Reel; Manufacturer: Molex; Current Rating: 500mA; Number of Contacts: 8; Pitch: 1.09mm; Insertion - Extraction Style: Hinged; Voltage Rating: 100VDC; Product: CardConnectors; Contact Material: CopperAlloy; Series: 47219; Packaging: Reel; Brand: Molex; Product Category: MemoryCardConnectors; Housing Material: Thermoplastic; Mounting Style: SMD/SMT; Termination Style: SMD; Datasheet Version: Rev. F, 06/2009; Card Type: microSD; Manufacturer URL: http://www.molex.com/; RoHS: Details; Datasheet URL: http://www.molex.com/pdm_docs/sd/472192001_sd.pdf; Factory Pack Quantity: 2400

## Sheet ADC088S022_VAR.SchDoc
size A4; SheetNumber: 15; SheetTotal: 15
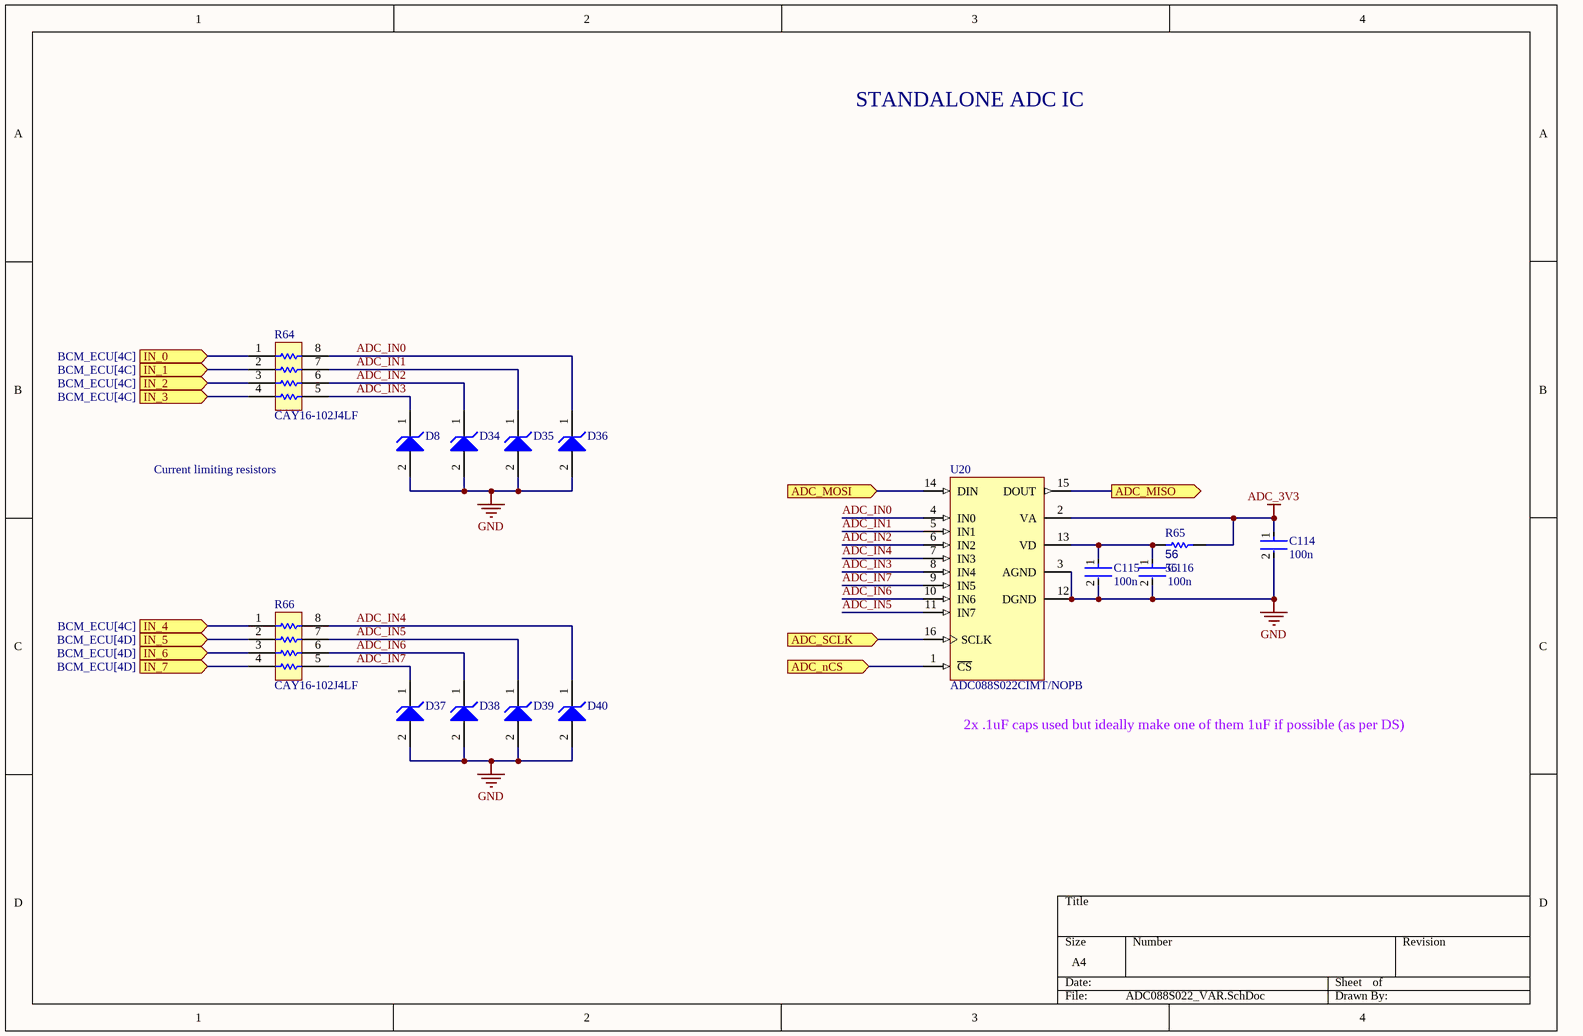
[diagram p19: ADC088S022_VAR.SchDoc]

### Parts
C114  100n  [FP-0402-L_1_0_0_05-W_0_5-IPC_A]
C115  100n  [FP-0402-L_1_0_0_05-W_0_5-IPC_A]
C116  100n  [FP-0402-L_1_0_0_05-W_0_5-IPC_A]
D8  MM5Z3V3T1G  [ONSC-SOD-523-2-502-01_V]  (value not drawn)
D34  MM5Z3V3T1G  [ONSC-SOD-523-2-502-01_V]  (value not drawn)
D35  MM5Z3V3T1G  [ONSC-SOD-523-2-502-01_V]  (value not drawn)
D36  MM5Z3V3T1G  [ONSC-SOD-523-2-502-01_V]  (value not drawn)
D37  MM5Z3V3T1G  [ONSC-SOD-523-2-502-01_V]  (value not drawn)
D38  MM5Z3V3T1G  [ONSC-SOD-523-2-502-01_V]  (value not drawn)
D39  MM5Z3V3T1G  [ONSC-SOD-523-2-502-01_V]  (value not drawn)
D40  MM5Z3V3T1G  [ONSC-SOD-523-2-502-01_V]  (value not drawn)
R64  CAY16-102J4LF  [BOUR-CAY16-J4_V]
R65  56  [R0603B]
R66  CAY16-102J4LF  [BOUR-CAY16-J4_V]
U20  ADC088S022CIMT/NOPB  [MTC16_L]

### Ports
ADC_MISO (out, see BCM_ECU[4C], ADC088S022[3B], MOSFET_BANK[1C]), ADC_MOSI (in, see BCM_ECU[4C], ADC088S022[3B], MOSFET_BANK[1C]), ADC_nCS (in, see BCM_ECU[4C]), ADC_SCLK (in, see BCM_ECU[4C], ADC088S022[3C], MOSFET_BANK[1D]), IN_0 (in, see BCM_ECU[4C]), IN_1 (in, see BCM_ECU[4C]), IN_2 (in, see BCM_ECU[4C]), IN_3 (in, see BCM_ECU[4C]), IN_4 (in, see BCM_ECU[4C]), IN_5 (in, see BCM_ECU[4D]), IN_6 (in, see BCM_ECU[4D]), IN_7 (in, see BCM_ECU[4D])

### Nets
ADC_3V3: C114.1 R65.1 U20.2(VA)
GND: C114.2 C115.2 C116.2 D8.2(A) D34.2(A) D35.2(A) D36.2(A) D37.2(A) D38.2(A) D39.2(A) D40.2(A) U20.3(AGND) U20.12(DGND)
3V3_V_SENSE: R66.1 ; port IN_4
5V_V_SENSE: R66.2 ; port IN_5
ADC_IN0: D36.1(K) R64.8 U20.4(IN0)
ADC_IN1: D35.1(K) R64.7 U20.5(IN1)
ADC_IN2: D34.1(K) R64.6 U20.6(IN2)
ADC_IN3: D8.1(K) R64.5 U20.8(IN4)
ADC_IN4: D40.1(K) R66.8 U20.7(IN3)
ADC_IN5: D39.1(K) R66.7 U20.11(IN7)
ADC_IN6: D38.1(K) R66.6 U20.10(IN6)
ADC_IN7: D37.1(K) R66.5 U20.9(IN5)
ADC_MISO: U20.15(DOUT) ; port ADC_MISO
ADC_MOSI: U20.14(DIN) ; port ADC_MOSI
ADC_SCLK: U20.16(SCLK) ; port ADC_SCLK
EXT_ADC_IN_0: R66.3 ; port IN_6
EXT_ADC_IN_1: R66.4 ; port IN_7
MOS_TEMP_0: R64.4 ; port IN_3
MOS_TEMP_1: R64.3 ; port IN_2
MOS_TEMP_2: R64.2 ; port IN_1
MOS_TEMP_3: R64.1 ; port IN_0
NetC115_1: C115.1 C116.1 R65.2 U20.13(VD)
NetU10_57: U20.1(~{CS}) ; port ADC_nCS

### Notes on the sheet
- STANDALONE ADC IC
- Current limiting resistors
- (near U20) 2x .1uF caps used but ideally make one of them 1uF if possible (as per DS)

### Library data of the parts
C114-C116 = CMP-001-00058-1: as C43 on sheet MCP23017_PINOUT; Min Operating Temperature: -55°C; Mounting Technology: Surface Mount; Pins: 2; Case/Package: 0402; RoHS Compliant: Yes; Max Operating Temperature: 85°C
D8 D34-D40 = CMP-1060-00750-1: as D9 on sheet MCP23017_PINOUT; RoHS: Pb-Free; ComponentLink2Description: Datasheet; PackageReference: SOD-523-2-502-01; DatasheetVersion: Rev. 10; ComponentLink1Description: Manufacturer URL; PackageVersion: Rev. E, 09/2010; ComponentLink3URL: http://www.onsemi.com/pub_link/Collateral/502-01.PDF; ComponentLink2URL: http://www.onsemi.cn/pub_link/Collateral/MM5Z2V4T1-D.PDF; Mounting Technology: Surface Mount; PartNumber: MM5Z3V3T1G; Packing: Tape and Reel; PackageDescription: 2-Pin SOD, Body 1.2 x 0.8 mm; ComponentLink1URL: http://www.onsemi.com/; ComponentLink3Description: Package Specification
R64 R66 = CMP-1747-00007-1: as R98-R101 on sheet MCP23017_PINOUT; RoHSCompliant: true; Case Code (Metric): 1608; Pins: 2; PackageDescription: 8-Pin Surface Mount Device, Body 1.6 x 3.2 mm, Pitch 0.8 mm; Height: 0.45 mm; Min Operating Temperature: -55 degC; ComponentLink1URL: http://www.bourns.com/; Case Code (Imperial): 0603; Packaging: Tape and Reel; PackageReference: CAY16-J4; ComponentLink1Description: Manufacturer URL; ComponentLink2Description: Datasheet; Length: 1.6 mm; Width: 0.8 mm; Max Operating Temperature: 155 degC; Mount: Surface Mount; DatasheetVersion: Sep-14; Voltage Rating: 50 V; REACH SVHC: No SVHC; ComponentLink2URL: http://www.bourns.com/pdfs/CATCAY.pdf; Package Quantity: 5000
R65 = CMP-009-00002-14: Resistor; Value: 56
U20 = CMP-0054-00372-2: 8-Channel, 50 kSPS to 200 kSPS, 8-Bit A/D Converter, 16-pin TSSOP, Pb-Free; Manufacturer: National Semiconductor; PackageTopMarking: NSUZXYTT*88S022*CIMT; CompType: ADC IC; PowerWise: Y; ComponentLink2URL: http://www.national.com/pf/AD/ADC088S022.html; RoHS: Y; PackageDescription: Molded TSSOP, Jedec, 5 x 4.4 x 0.9mm Body, 16 Lead, 0.65mm Pitch; DatasheetVersion: Feb-2010; PinCount: 16; ComponentLink1Description: ADC088S022 Datasheet; Code_JEDEC: MO-153-AB; ComponentLink3URL: http://www.national.com/packaging/folders/mtc16.html; PackageVersion: revD, Jun-2003; ComponentLink3Description: MTC16 Package Page; RevisionNote: Component URLs added; ComponentLink1URL: http://www.national.com/ds/AD/ADC088S022.pdf; ComponentLink2Description: ADC088S022 Web Page; PackageReference: MTC16

## Nets that join several sheets
3V3: BCM_ECU (F8.1 F9.1 F11.1 F13.1), STM32H730_PINOUT (24 pins), TCAN1146_PWR_MGMT (C10.1 U8.5), MOSFET_BANK_0 (R7_MOSFET_BANK_0.2 R8_MOSFET_BANK_0.2), MOSFET_BANK_1 (R7_MOSFET_BANK_1.2 R8_MOSFET_BANK_1.2), MOSFET_BANK_2 (R7_MOSFET_BANK_2.2 R8_MOSFET_BANK_2.2), MOSFET_BANK_3 (R7_MOSFET_BANK_3.2 R8_MOSFET_BANK_3.2), INT_REG (5 pins), EEPROM (C77.1 R36.2 R53.2 U16.8), SD_CARD (F7.1)
5V: TCAN1146_PWR_MGMT (C9.1 U8.3), INT_REG (C15.1 R125.1 U9.2 U9.4)
ADC_3V3: BCM_ECU (F13.2), MOSFET_BANK_0 (C5_MOSFET_BANK_0.1 R12_MOSFET_BANK_0.1 R16_MOSFET_BANK_0.1 U6_MOSFET_BANK_0.2), MOSFET_BANK_1 (C5_MOSFET_BANK_1.1 R12_MOSFET_BANK_1.1 R16_MOSFET_BANK_1.1 U6_MOSFET_BANK_1.2), MOSFET_BANK_2 (C5_MOSFET_BANK_2.1 R12_MOSFET_BANK_2.1 R16_MOSFET_BANK_2.1 U6_MOSFET_BANK_2.2), ADC_0 (C49_ADC_0.1 R60_ADC_0.1 U13_ADC_0.2), MOSFET_BANK_3 (C5_MOSFET_BANK_3.1 R12_MOSFET_BANK_3.1 R16_MOSFET_BANK_3.1 U6_MOSFET_BANK_3.2), ADC_1 (C49_ADC_1.1 R60_ADC_1.1 U13_ADC_1.2), ADC088S022_VAR (C114.1 R65.1 U20.2)
BCM_VCC: MOSFET_BANK_0 (8 pins), MOSFET_BANK_1 (8 pins), MOSFET_BANK_2 (8 pins), MOSFET_BANK_3 (8 pins), PWR_PROT_1 (R47_PWR_PROT_1.1 U12_PWR_PROT_1.3 U12_PWR_PROT_1.4)
GND: BCM_ECU (23 pins), STM32H730_PINOUT (34 pins), TCAN1146_PWR_MGMT (17 pins), MOSFET_BANK_0 (24 pins), MOSFET_BANK_1 (24 pins), MOSFET_BANK_2 (24 pins), ADC_0 (13 pins), BYPASS_0 (Q8_BYPASS_0.1 R57_BYPASS_0.2 R59_BYPASS_0.1), MOSFET_BANK_3 (24 pins), BYPASS_1 (Q8_BYPASS_1.1 R57_BYPASS_1.2 R59_BYPASS_1.1), BYPASS_2 (Q8_BYPASS_2.1 R57_BYPASS_2.2 R59_BYPASS_2.1), BYPASS_3 (Q8_BYPASS_3.1 R57_BYPASS_3.2 R59_BYPASS_3.1), BOOST_REG (41 pins), INT_REG (11 pins), EEPROM (C77.2 U16.4), PWR_PROT_REV (C109.2 D23.2 R110.2 U19.5), PWR_PROT_1 (C40_PWR_PROT_1.2 D6_PWR_PROT_1.2 R49_PWR_PROT_1.2 U12_PWR_PROT_1.5), PWR_PROT_2 (C40_PWR_PROT_2.2 D6_PWR_PROT_2.2 R49_PWR_PROT_2.2 U12_PWR_PROT_2.5), PWR_PROT_3 (C40_PWR_PROT_3.2 D6_PWR_PROT_3.2 R49_PWR_PROT_3.2 U12_PWR_PROT_3.5), PWR_PROT_4 (C40_PWR_PROT_4.2 D6_PWR_PROT_4.2 R49_PWR_PROT_4.2 U12_PWR_PROT_4.5), PWR_PROT_5 (C40_PWR_PROT_5.2 D6_PWR_PROT_5.2 R49_PWR_PROT_5.2 U12_PWR_PROT_5.5), ADC_1 (13 pins), IO_CHECKER_0 (19 pins), IO_CHECKER_1 (19 pins), TPA3255_PINOUT (41 pins), SD_CARD (13 pins), ADC088S022_VAR (13 pins)
IO_CHECKER_3V3: BCM_ECU (F11.2 R67.2 R68.2), IO_CHECKER_0 (6 pins), IO_CHECKER_1 (6 pins)
LED_A: BCM_ECU (J2.5), PWR_PROT_2 (R47_PWR_PROT_2.1 U12_PWR_PROT_2.3 U12_PWR_PROT_2.4)
LED_B: BCM_ECU (J2.6), PWR_PROT_3 (R47_PWR_PROT_3.1 U12_PWR_PROT_3.3 U12_PWR_PROT_3.4)
LED_C: BCM_ECU (J2.11), PWR_PROT_4 (R47_PWR_PROT_4.1 U12_PWR_PROT_4.3 U12_PWR_PROT_4.4)
LED_D: BCM_ECU (J2.12), PWR_PROT_5 (R47_PWR_PROT_5.1 U12_PWR_PROT_5.3 U12_PWR_PROT_5.4)
MOS_SENSE_3V3: BCM_ECU (F9.2), MOSFET_BANK_0 (8 pins), MOSFET_BANK_1 (8 pins), MOSFET_BANK_2 (8 pins), MOSFET_BANK_3 (8 pins)
PRE_BST_AMP_VCC: BOOST_REG (10 pins), PWR_PROT_REV (R109.1 U19.1 U19.2), TPA3255_PINOUT (C117.2 U21.1)
PWR_OUT: BCM_ECU (F1.1), TCAN1146_PWR_MGMT (R29.2 U7.1 U7.2), PWR_PROT_REV (XF3.1 XF3.2), PWR_PROT_1 (XF2_PWR_PROT_1.1 XF2_PWR_PROT_1.2), PWR_PROT_2 (XF2_PWR_PROT_2.1 XF2_PWR_PROT_2.2), PWR_PROT_3 (XF2_PWR_PROT_3.1 XF2_PWR_PROT_3.2), PWR_PROT_4 (XF2_PWR_PROT_4.1 XF2_PWR_PROT_4.2), PWR_PROT_5 (XF2_PWR_PROT_5.1 XF2_PWR_PROT_5.2)
PWR_SENSE_3V3: BCM_ECU (F8.2), TCAN1146_PWR_MGMT (C8.1 R26.2 U7.8), BOOST_REG (C104.1 R88.1 U15.8), PWR_PROT_REV (C109.1 R107.1 U19.8), PWR_PROT_1 (C40_PWR_PROT_1.1 R50_PWR_PROT_1.1 U12_PWR_PROT_1.8), PWR_PROT_2 (C40_PWR_PROT_2.1 R50_PWR_PROT_2.1 U12_PWR_PROT_2.8), PWR_PROT_3 (C40_PWR_PROT_3.1 R50_PWR_PROT_3.1 U12_PWR_PROT_3.8), PWR_PROT_4 (C40_PWR_PROT_4.1 R50_PWR_PROT_4.1 U12_PWR_PROT_4.8), PWR_PROT_5 (C40_PWR_PROT_5.1 R50_PWR_PROT_5.1 U12_PWR_PROT_5.8)
3V3_V_SENSE: INT_REG (D46.1 R48.2 R51.1), ADC088S022_VAR (R66.1)
5V_V_SENSE: INT_REG (D47.1 R125.2 R126.1), ADC088S022_VAR (R66.2)
ADC_MISO: STM32H730_PINOUT (U10.30), MOSFET_BANK_0 (U6_MOSFET_BANK_0.15), MOSFET_BANK_1 (U6_MOSFET_BANK_1.15), MOSFET_BANK_2 (U6_MOSFET_BANK_2.15), ADC_0 (U13_ADC_0.15), MOSFET_BANK_3 (U6_MOSFET_BANK_3.15), ADC_1 (U13_ADC_1.15), ADC088S022_VAR (U20.15)
ADC_MOSI: STM32H730_PINOUT (U10.31), MOSFET_BANK_0 (U6_MOSFET_BANK_0.14), MOSFET_BANK_1 (U6_MOSFET_BANK_1.14), MOSFET_BANK_2 (U6_MOSFET_BANK_2.14), ADC_0 (U13_ADC_0.14), MOSFET_BANK_3 (U6_MOSFET_BANK_3.14), ADC_1 (U13_ADC_1.14), ADC088S022_VAR (U20.14)
ADC_nCS: STM32H730_PINOUT (U10.64), MOSFET_BANK_1 (U6_MOSFET_BANK_1.1)
ADC_nCS: STM32H730_PINOUT (U10.65), MOSFET_BANK_2 (U6_MOSFET_BANK_2.1)
ADC_nCS: STM32H730_PINOUT (U10.28), MOSFET_BANK_0 (U6_MOSFET_BANK_0.1)
ADC_nCS: STM32H730_PINOUT (U10.56), MOSFET_BANK_3 (U6_MOSFET_BANK_3.1)
ADC_SCLK: STM32H730_PINOUT (U10.29), MOSFET_BANK_0 (U6_MOSFET_BANK_0.16), MOSFET_BANK_1 (U6_MOSFET_BANK_1.16), MOSFET_BANK_2 (U6_MOSFET_BANK_2.16), ADC_0 (U13_ADC_0.16), MOSFET_BANK_3 (U6_MOSFET_BANK_3.16), ADC_1 (U13_ADC_1.16), ADC088S022_VAR (U20.16)
AMP_I_SENSE: PWR_PROT_REV (R108.1), ADC_1 (R62_ADC_1.4)
AMP_V_SENSE: PWR_PROT_REV (D23.1 R109.2 R110.1), ADC_1 (R62_ADC_1.3)
AMP_VCC: BOOST_REG (R105.1 U15.3 U15.4), TPA3255_PINOUT (12 pins)
BCM_I_SENSE: PWR_PROT_1 (R52_PWR_PROT_1.1), ADC_1 (R62_ADC_1.1)
BCM_V_SENSE: PWR_PROT_1 (D6_PWR_PROT_1.1 R47_PWR_PROT_1.2 R49_PWR_PROT_1.1), ADC_1 (R62_ADC_1.2)
BST_I_SENSE: ADC_0 (R62_ADC_0.3), BOOST_REG (R111.1)
BST_V_SENSE: ADC_0 (R62_ADC_0.4), BOOST_REG (R105.2 R106.1)
CAN_MISO: STM32H730_PINOUT (U10.4), TCAN1146_PWR_MGMT (U8.6), EEPROM (U16.2)
CAN_MOSI: STM32H730_PINOUT (U10.5), TCAN1146_PWR_MGMT (U8.11), EEPROM (U16.5)
CAN_N: BCM_ECU (J1.30), TCAN1146_PWR_MGMT (C12.1 D3.2 L1.4 R35.2)
CAN_nCS: STM32H730_PINOUT (U10.2), TCAN1146_PWR_MGMT (U8.14)
CAN_P: BCM_ECU (J1.29), TCAN1146_PWR_MGMT (C14.2 D3.1 L1.1 R37.1)
CAN_RX: STM32H730_PINOUT (U10.95), TCAN1146_PWR_MGMT (U8.4)
CAN_SCLK: STM32H730_PINOUT (U10.1), TCAN1146_PWR_MGMT (U8.8), EEPROM (U16.6)
CAN_TX: STM32H730_PINOUT (U10.96), TCAN1146_PWR_MGMT (U8.1)
EXT_ADC_IN_0: BCM_ECU (J2.7), ADC088S022_VAR (R66.3)
EXT_ADC_IN_1: BCM_ECU (J2.8), ADC088S022_VAR (R66.4)
EXT_IN_0: BCM_ECU (J1.34), BYPASS_0 (F6_BYPASS_0.1), IO_CHECKER_0 (R100_IO_CHECKER_0.4)
EXT_IN_1: BCM_ECU (J1.35), BYPASS_1 (F6_BYPASS_1.1), IO_CHECKER_0 (R100_IO_CHECKER_0.1)
EXT_IN_2: BCM_ECU (J1.23), BYPASS_2 (F6_BYPASS_2.1), IO_CHECKER_0 (R100_IO_CHECKER_0.2)
EXT_IN_3: BCM_ECU (J1.22), BYPASS_3 (F6_BYPASS_3.1), IO_CHECKER_0 (R101_IO_CHECKER_0.1)
EXT_INT_0: BCM_ECU (J2.19), IO_CHECKER_0 (R99_IO_CHECKER_0.2)
EXT_INT_1: BCM_ECU (J2.20), IO_CHECKER_0 (R98_IO_CHECKER_0.4)
EXT_INT_2: BCM_ECU (J2.21), IO_CHECKER_0 (R98_IO_CHECKER_0.2)
EXT_INT_3: BCM_ECU (J2.30), IO_CHECKER_0 (R99_IO_CHECKER_0.3)
EXT_INT_4: BCM_ECU (J2.31), IO_CHECKER_0 (R99_IO_CHECKER_0.1)
EXT_INT_5: BCM_ECU (J2.32), IO_CHECKER_0 (R98_IO_CHECKER_0.3)
EXT_INT_6: BCM_ECU (J2.33), IO_CHECKER_0 (R98_IO_CHECKER_0.1)
IO_CHKR_SCL: BCM_ECU (R68.1), STM32H730_PINOUT (U10.92), IO_CHECKER_0 (U17_IO_CHECKER_0.12), IO_CHECKER_1 (U17_IO_CHECKER_1.12)
IO_CHKR_SDA: BCM_ECU (R67.1), STM32H730_PINOUT (U10.93), IO_CHECKER_0 (U17_IO_CHECKER_0.13), IO_CHECKER_1 (U17_IO_CHECKER_1.13)
LED_A_I_SENSE: PWR_PROT_2 (R52_PWR_PROT_2.1), ADC_1 (R61_ADC_1.2)
LED_A_V_SENSE: PWR_PROT_2 (D6_PWR_PROT_2.1 R47_PWR_PROT_2.2 R49_PWR_PROT_2.1), ADC_1 (R61_ADC_1.1)
LED_B_I_SENSE: ADC_0 (R61_ADC_0.1), PWR_PROT_3 (R52_PWR_PROT_3.1)
LED_B_V_SENSE: ADC_0 (R61_ADC_0.2), PWR_PROT_3 (D6_PWR_PROT_3.1 R47_PWR_PROT_3.2 R49_PWR_PROT_3.1)
LED_C_I_SENSE: ADC_0 (R61_ADC_0.3), PWR_PROT_4 (R52_PWR_PROT_4.1)
LED_C_V_SENSE: ADC_0 (R61_ADC_0.4), PWR_PROT_4 (D6_PWR_PROT_4.1 R47_PWR_PROT_4.2 R49_PWR_PROT_4.1)
LED_D_I_SENSE: ADC_0 (R62_ADC_0.2), PWR_PROT_5 (R52_PWR_PROT_5.1)
LED_D_V_SENSE: ADC_0 (R62_ADC_0.1), PWR_PROT_5 (D6_PWR_PROT_5.1 R47_PWR_PROT_5.2 R49_PWR_PROT_5.1)
MAIN_I_SENSE: TCAN1146_PWR_MGMT (R63.1), ADC_1 (R61_ADC_1.3)
MAIN_V_SENSE: TCAN1146_PWR_MGMT (D45.1 R29.1 R31.2), ADC_1 (R61_ADC_1.4)
MOS_TEMP_0: MOSFET_BANK_0 (R11_MOSFET_BANK_0.2 R12_MOSFET_BANK_0.2), ADC088S022_VAR (R64.4)
MOS_TEMP_1: MOSFET_BANK_1 (R11_MOSFET_BANK_1.2 R12_MOSFET_BANK_1.2), ADC088S022_VAR (R64.3)
MOS_TEMP_2: MOSFET_BANK_2 (R11_MOSFET_BANK_2.2 R12_MOSFET_BANK_2.2), ADC088S022_VAR (R64.2)
MOS_TEMP_3: MOSFET_BANK_3 (R11_MOSFET_BANK_3.2 R12_MOSFET_BANK_3.2), ADC088S022_VAR (R64.1)
NetC16_1: BCM_ECU (F1.2), INT_REG (5 pins)
NetC44_2: STM32H730_PINOUT (U10.63), TPA3255_PINOUT (C44.2)
NetQ1_5-6-7-8: BCM_ECU (XF1.3 XF1.4), TCAN1146_PWR_MGMT (Q1.5-6-7-8 Q3.5-6-7-8)
NetR1_MOSFET_BANK_0_1: STM32H730_PINOUT (U10.36), MOSFET_BANK_0 (R1_MOSFET_BANK_0.1)
NetR1_MOSFET_BANK_1_1: STM32H730_PINOUT (U10.25), MOSFET_BANK_1 (R1_MOSFET_BANK_1.1)
NetR1_MOSFET_BANK_2_1: STM32H730_PINOUT (U10.87), MOSFET_BANK_2 (R1_MOSFET_BANK_2.1)
NetR1_MOSFET_BANK_3_1: STM32H730_PINOUT (U10.77), MOSFET_BANK_3 (R1_MOSFET_BANK_3.1)
NetR2_MOSFET_BANK_0_1: STM32H730_PINOUT (U10.35), MOSFET_BANK_0 (R2_MOSFET_BANK_0.1)
NetR2_MOSFET_BANK_1_1: STM32H730_PINOUT (U10.23), MOSFET_BANK_1 (R2_MOSFET_BANK_1.1)
NetR2_MOSFET_BANK_2_1: STM32H730_PINOUT (U10.85), MOSFET_BANK_2 (R2_MOSFET_BANK_2.1)
NetR2_MOSFET_BANK_3_1: STM32H730_PINOUT (U10.70), MOSFET_BANK_3 (R2_MOSFET_BANK_3.1)
NetR3_MOSFET_BANK_0_1: STM32H730_PINOUT (U10.33), MOSFET_BANK_0 (R3_MOSFET_BANK_0.1)
NetR3_MOSFET_BANK_1_1: STM32H730_PINOUT (U10.22), MOSFET_BANK_1 (R3_MOSFET_BANK_1.1)
NetR3_MOSFET_BANK_2_1: STM32H730_PINOUT (U10.84), MOSFET_BANK_2 (R3_MOSFET_BANK_2.1)
NetR3_MOSFET_BANK_3_1: STM32H730_PINOUT (U10.69), MOSFET_BANK_3 (R3_MOSFET_BANK_3.1)
NetR4_MOSFET_BANK_0_1: STM32H730_PINOUT (U10.32), MOSFET_BANK_0 (R4_MOSFET_BANK_0.1)
NetR4_MOSFET_BANK_1_1: STM32H730_PINOUT (U10.15), MOSFET_BANK_1 (R4_MOSFET_BANK_1.1)
NetR4_MOSFET_BANK_2_1: STM32H730_PINOUT (U10.81), MOSFET_BANK_2 (R4_MOSFET_BANK_2.1)
NetR4_MOSFET_BANK_3_1: STM32H730_PINOUT (U10.67), MOSFET_BANK_3 (R4_MOSFET_BANK_3.1)
NetR5_MOSFET_BANK_0_1: STM32H730_PINOUT (U10.37), MOSFET_BANK_0 (R5_MOSFET_BANK_0.1)
NetR5_MOSFET_BANK_1_1: STM32H730_PINOUT (U10.24), MOSFET_BANK_1 (R5_MOSFET_BANK_1.1)
NetR5_MOSFET_BANK_2_1: STM32H730_PINOUT (U10.86), MOSFET_BANK_2 (R5_MOSFET_BANK_2.1)
NetR5_MOSFET_BANK_3_1: STM32H730_PINOUT (U10.71), MOSFET_BANK_3 (R5_MOSFET_BANK_3.1)
NetR6_MOSFET_BANK_0_1: STM32H730_PINOUT (U10.34), MOSFET_BANK_0 (R6_MOSFET_BANK_0.1)
NetR6_MOSFET_BANK_1_1: STM32H730_PINOUT (U10.16), MOSFET_BANK_1 (R6_MOSFET_BANK_1.1)
NetR6_MOSFET_BANK_2_1: STM32H730_PINOUT (U10.82), MOSFET_BANK_2 (R6_MOSFET_BANK_2.1)
NetR6_MOSFET_BANK_3_1: STM32H730_PINOUT (U10.68), MOSFET_BANK_3 (R6_MOSFET_BANK_3.1)
NetR9_2: BCM_ECU (R9.2), STM32H730_PINOUT (U10.59)
NetR10_2: BCM_ECU (R10.2), STM32H730_PINOUT (U10.53)
NetR26_1: STM32H730_PINOUT (U10.38), TCAN1146_PWR_MGMT (R26.1 U7.6)
NetR36_1: STM32H730_PINOUT (U10.3), EEPROM (R36.1 U16.7)
NetR50_PWR_PROT_1_2: STM32H730_PINOUT (U10.44), PWR_PROT_1 (R50_PWR_PROT_1.2 U12_PWR_PROT_1.6)
NetR50_PWR_PROT_2_2: STM32H730_PINOUT (U10.40), PWR_PROT_2 (R50_PWR_PROT_2.2 U12_PWR_PROT_2.6)
NetR50_PWR_PROT_3_2: STM32H730_PINOUT (U10.41), PWR_PROT_3 (R50_PWR_PROT_3.2 U12_PWR_PROT_3.6)
NetR50_PWR_PROT_4_2: STM32H730_PINOUT (U10.42), PWR_PROT_4 (R50_PWR_PROT_4.2 U12_PWR_PROT_4.6)
NetR50_PWR_PROT_5_2: STM32H730_PINOUT (U10.43), PWR_PROT_5 (R50_PWR_PROT_5.2 U12_PWR_PROT_5.6)
NetR70_2: BCM_ECU (R70.2), STM32H730_PINOUT (U10.46)
NetR71_2: BCM_ECU (R71.2), STM32H730_PINOUT (U10.39)
NetR87_2: STM32H730_PINOUT (U10.47), BOOST_REG (R87.2)
NetR88_2: STM32H730_PINOUT (U10.51), BOOST_REG (R88.2 U15.6)
NetR107_2: STM32H730_PINOUT (U10.45), PWR_PROT_REV (R107.2 U19.6)
NetR121_IO_CHECKER_0_1: STM32H730_PINOUT (U10.62), IO_CHECKER_0 (R121_IO_CHECKER_0.1 U17_IO_CHECKER_0.18)
NetR121_IO_CHECKER_1_1: STM32H730_PINOUT (U10.88), IO_CHECKER_1 (R121_IO_CHECKER_1.1 U17_IO_CHECKER_1.18)
NetU10_7: STM32H730_PINOUT (U10.7), EEPROM (U16.1)
NetU10_17: STM32H730_PINOUT (U10.17), TPA3255_PINOUT (U18.21)
NetU10_18: STM32H730_PINOUT (U10.18), TPA3255_PINOUT (U18.18)
NetU10_54: STM32H730_PINOUT (U10.54), TPA3255_PINOUT (U18.19)
NetU10_55: STM32H730_PINOUT (U10.55), ADC_0 (U13_ADC_0.1)
NetU10_57: STM32H730_PINOUT (U10.57), ADC088S022_VAR (U20.1)
NetU10_58: STM32H730_PINOUT (U10.58), ADC_1 (U13_ADC_1.1)
NetU10_60: STM32H730_PINOUT (U10.60), IO_CHECKER_0 (U17_IO_CHECKER_0.19)
NetU10_61: STM32H730_PINOUT (U10.61), IO_CHECKER_0 (U17_IO_CHECKER_0.20)
NetU10_90: STM32H730_PINOUT (U10.90), IO_CHECKER_1 (U17_IO_CHECKER_1.19)
NetU10_91: STM32H730_PINOUT (U10.91), IO_CHECKER_1 (U17_IO_CHECKER_1.20)
OUT_0: BCM_ECU (J1.11), MOSFET_BANK_0 (F2_MOSFET_BANK_0.2), BYPASS_0 (Q7_BYPASS_0.5-6-7-8), IO_CHECKER_0 (R101_IO_CHECKER_0.2)
OUT_1: BCM_ECU (J1.12), MOSFET_BANK_0 (F3_MOSFET_BANK_0.2), BYPASS_1 (Q7_BYPASS_1.5-6-7-8), IO_CHECKER_0 (R100_IO_CHECKER_0.3)
OUT_2: BCM_ECU (J1.9), MOSFET_BANK_0 (F4_MOSFET_BANK_0.2), BYPASS_2 (Q7_BYPASS_2.5-6-7-8), IO_CHECKER_1 (R99_IO_CHECKER_1.2)
OUT_3: BCM_ECU (J1.10), MOSFET_BANK_0 (F5_MOSFET_BANK_0.2), BYPASS_3 (Q7_BYPASS_3.5-6-7-8), IO_CHECKER_1 (R99_IO_CHECKER_1.3)
OUT_4: BCM_ECU (J1.7), MOSFET_BANK_1 (F2_MOSFET_BANK_1.2), IO_CHECKER_1 (R98_IO_CHECKER_1.4)
OUT_5: BCM_ECU (J1.8), MOSFET_BANK_1 (F3_MOSFET_BANK_1.2), IO_CHECKER_1 (R99_IO_CHECKER_1.1)
OUT_6: BCM_ECU (J1.5), MOSFET_BANK_1 (F4_MOSFET_BANK_1.2), IO_CHECKER_1 (R98_IO_CHECKER_1.2)
OUT_7: BCM_ECU (J1.6), MOSFET_BANK_1 (F5_MOSFET_BANK_1.2), IO_CHECKER_1 (R98_IO_CHECKER_1.3)
OUT_8: BCM_ECU (J1.3), MOSFET_BANK_2 (F2_MOSFET_BANK_2.2), IO_CHECKER_1 (R101_IO_CHECKER_1.3)
OUT_9: BCM_ECU (J1.4), MOSFET_BANK_2 (F3_MOSFET_BANK_2.2), IO_CHECKER_1 (R98_IO_CHECKER_1.1)
OUT_10: BCM_ECU (J1.1), MOSFET_BANK_2 (F4_MOSFET_BANK_2.2), IO_CHECKER_1 (R100_IO_CHECKER_1.3)
OUT_11: BCM_ECU (J1.2), MOSFET_BANK_2 (F5_MOSFET_BANK_2.2), IO_CHECKER_1 (R101_IO_CHECKER_1.1)
OUT_12: BCM_ECU (J1.13), MOSFET_BANK_3 (F2_MOSFET_BANK_3.2), IO_CHECKER_1 (R100_IO_CHECKER_1.2)
OUT_13: BCM_ECU (J1.24), MOSFET_BANK_3 (F3_MOSFET_BANK_3.2), IO_CHECKER_1 (R100_IO_CHECKER_1.1)
OUT_14: BCM_ECU (J1.26), MOSFET_BANK_3 (F4_MOSFET_BANK_3.2), IO_CHECKER_1 (R101_IO_CHECKER_1.2)
OUT_15: BCM_ECU (J1.25), MOSFET_BANK_3 (F5_MOSFET_BANK_3.2), IO_CHECKER_1 (R100_IO_CHECKER_1.4)
SD_CLK: STM32H730_PINOUT (U10.80), SD_CARD (R117.1)
SD_CMD: STM32H730_PINOUT (U10.83), SD_CARD (R118.1)
SD_DAT0: STM32H730_PINOUT (U10.52), SD_CARD (R112.1)
SD_DAT1: STM32H730_PINOUT (U10.66), SD_CARD (R113.1)
SD_DAT2: STM32H730_PINOUT (U10.78), SD_CARD (R114.1)
SD_DAT3: STM32H730_PINOUT (U10.79), SD_CARD (R115.1)
SPKR_A: BCM_ECU (J2.10), TPA3255_PINOUT (5 pins)
SPKR_B: BCM_ECU (J2.9), TPA3255_PINOUT (5 pins)